# Altium project LINDIY_Proj.PrjPCB
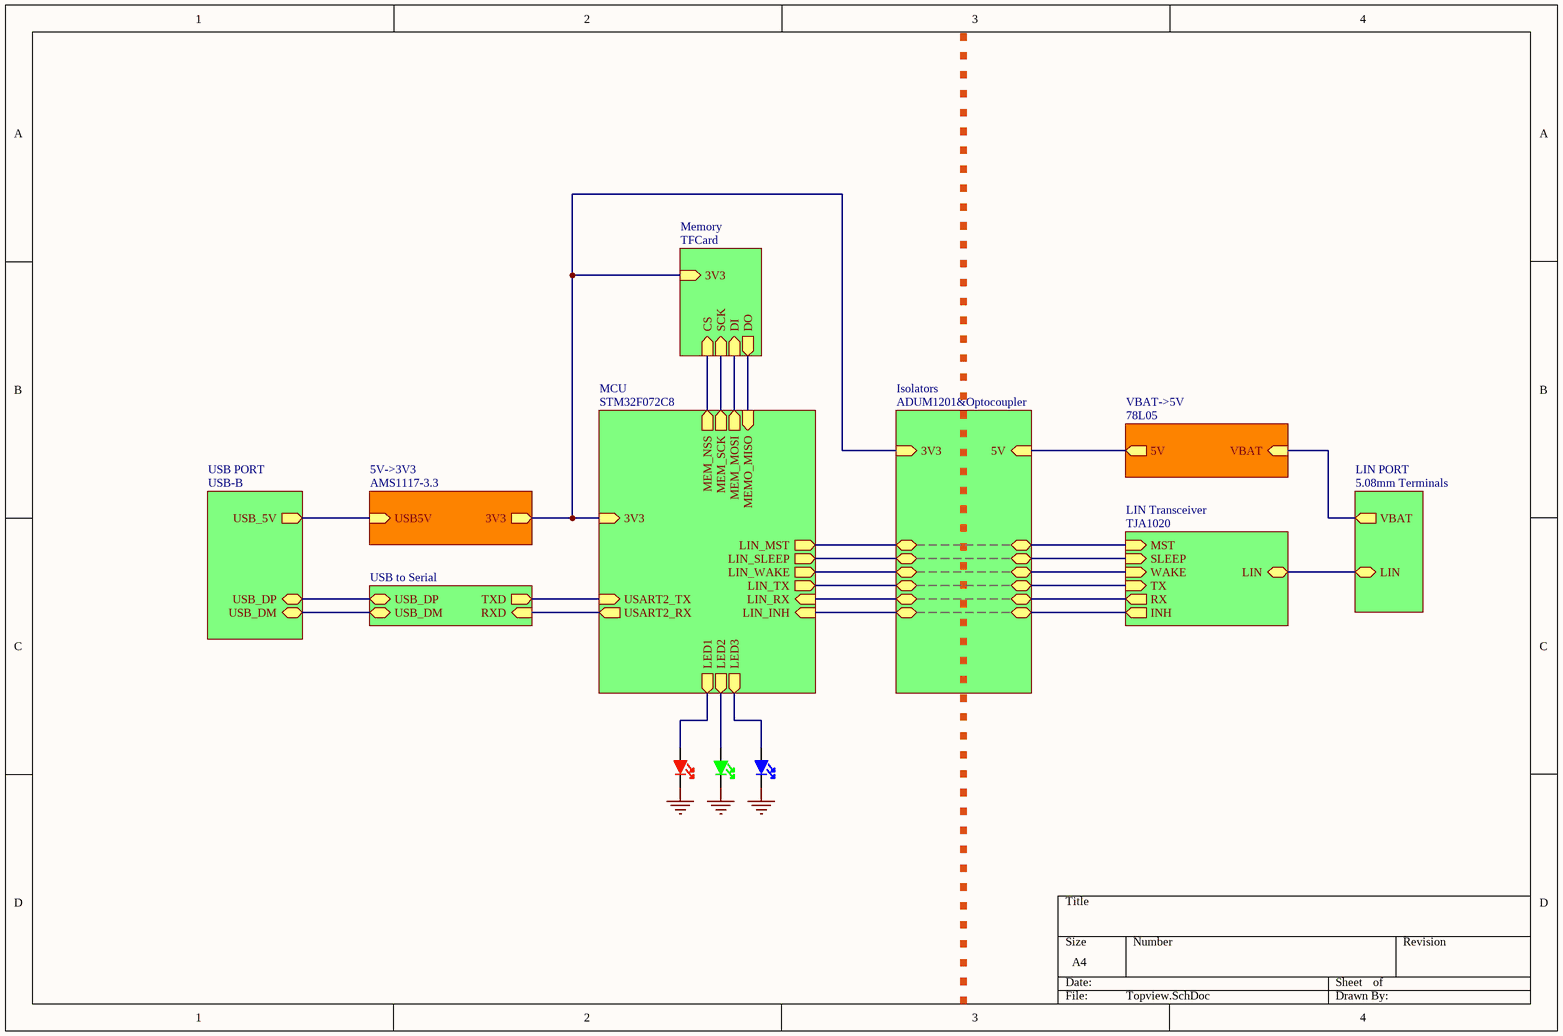
[diagram p0: Topview.SchDoc]
2 sheets, 76 parts. Net scope: hierarchical (ports join the sheet entries above them; power ports are global).
Board files: outline.PcbDoc, LINDIY.PcbDoc
Sheets:
  Topview.SchDoc
  LINDIY.SchDoc

## Sheet Topview.SchDoc
size A4

### Parts
(Parts that share a designator on the sheet are numbered #1, #2 ... from top to bottom, then left to right.)
?#1  LED_RED  [LED3]  (value not drawn)
?#2  LED_GREEG  [LED3]  (value not drawn)
?#3  LED_RED  [LED3]  (value not drawn)

### Sub-sheets
5V->3V3 = AMS1117-3.3 (file not in this document): USB5V (in), 3V3 (out)
Isolators = ADUM1201&Optocoupler (file not in this document): 3V3 (in), 5V (in), , , , , , , , , , , , 
LIN PORT = 5.08mm Terminals (file not in this document): VBAT (out), LIN
LIN Transceiver = TJA1020 (file not in this document): LIN, TX (in), RX (out), SLEEP (in), WAKE (in), INH (out), MST (in)
MCU = STM32F072C8 (file not in this document): USART2_TX, USART2_RX, LIN_TX (out), LIN_RX (in), LIN_SLEEP (out), LIN_WAKE (out), LIN_INH (in), MEM_NSS (out), MEM_SCK (out), MEM_MOSI (out), MEMO_MISO (in), LED1 (out), LED2 (out), LED3 (out), LIN_MST (out), 3V3 (in)
Memory = TFCard (file not in this document): CS (in), DI (in), SCK (in), DO (out), 3V3 (in)
USB PORT = USB-B (file not in this document): USB_DM, USB_DP, USB_5V (out)
USB to Serial = ?: USB_DP, TXD, RXD, USB_DM
VBAT->5V = 78L05 (file not in this document): VBAT (in), 5V (out)

### Nets
Net?#1_K: ?#1.K(k) ?#2.K(k) ?#3.K(k)
Net?#1_A: ?#1.A(a) ; sheet MCU/LED1
Net?#2_A: ?#2.A(a) ; sheet MCU/LED2
Net?#3_A: ?#3.A(a) ; sheet MCU/LED3
(unnamed): sheet USB PORT/USB_DM, sheet USB to Serial/USB_DM
(unnamed): sheet USB PORT/USB_DP, sheet USB to Serial/USB_DP
(unnamed): sheet USB PORT/USB_5V, sheet 5V->3V3/USB5V
(unnamed): sheet 5V->3V3/3V3, sheet MCU/3V3, sheet Memory/3V3, sheet Isolators/3V3
(unnamed): sheet USB to Serial/TXD, sheet MCU/USART2_TX
(unnamed): sheet USB to Serial/RXD, sheet MCU/USART2_RX
(unnamed): sheet LIN Transceiver/LIN, sheet LIN PORT/LIN
(unnamed): sheet LIN Transceiver/TX, sheet Isolators/
(unnamed): sheet LIN Transceiver/RX, sheet Isolators/
(unnamed): sheet LIN Transceiver/SLEEP, sheet Isolators/
(unnamed): sheet LIN Transceiver/WAKE, sheet Isolators/
(unnamed): sheet LIN Transceiver/INH, sheet Isolators/
(unnamed): sheet LIN Transceiver/MST, sheet Isolators/
(unnamed): sheet MCU/LIN_TX, sheet Isolators/
(unnamed): sheet MCU/LIN_RX, sheet Isolators/
(unnamed): sheet MCU/LIN_SLEEP, sheet Isolators/
(unnamed): sheet MCU/LIN_WAKE, sheet Isolators/
(unnamed): sheet MCU/LIN_INH, sheet Isolators/
(unnamed): sheet MCU/MEM_NSS, sheet Memory/CS
(unnamed): sheet MCU/MEM_SCK, sheet Memory/SCK
(unnamed): sheet MCU/MEM_MOSI, sheet Memory/DI
(unnamed): sheet MCU/MEMO_MISO, sheet Memory/DO
(unnamed): sheet MCU/LIN_MST, sheet Isolators/
(unnamed): sheet LIN PORT/VBAT, sheet VBAT->5V/VBAT
(unnamed): sheet VBAT->5V/5V, sheet Isolators/5V

### Library data of the parts
?#1 = LED-R
?#2 = LED-G
?#3 = LED-B

## Sheet LINDIY.SchDoc
size A3
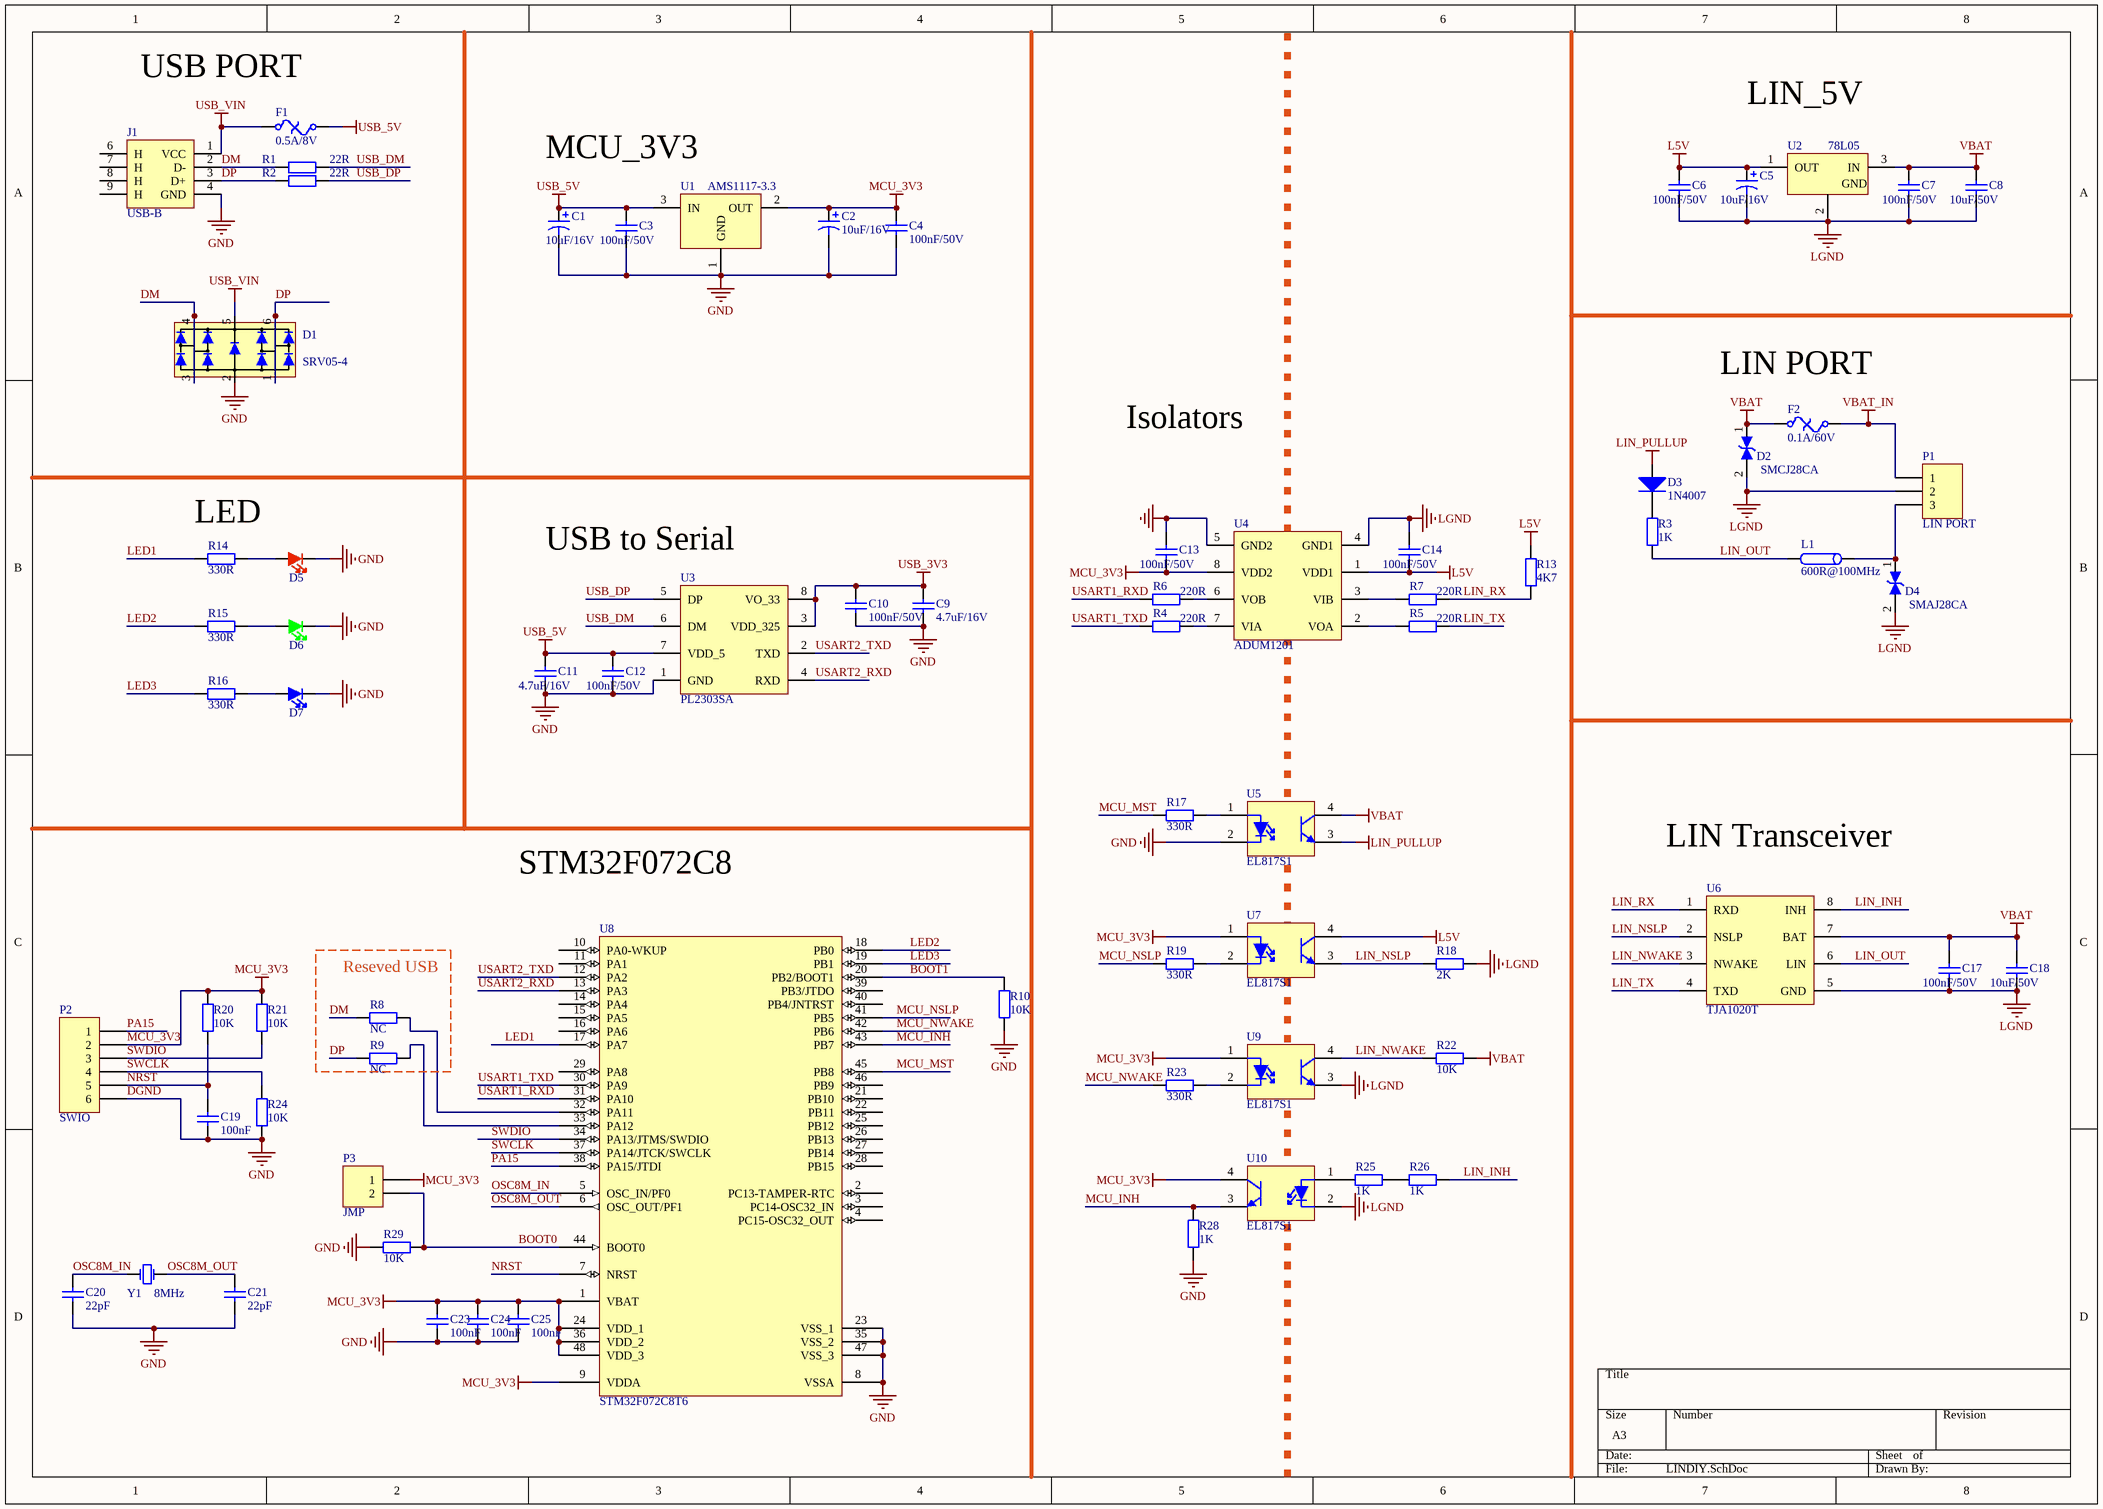
[diagram p1: LINDIY.SchDoc]

### Parts
C1  10uF/16V  [LC-CASE-A_3216]
C2  10uF/16V  [LC-CASE-A_3216]
C3  100nF/50V  [LC-0603_C]
C4  100nF/50V  [LC-0603_C]
C5  10uF/16V  [LC-CASE-A_3216]
C6  100nF/50V  [LC-0603_C]
C7  100nF/50V  [LC-0603_C]
C8  10uF/50V  [LC-1206_C]
C9  4.7uF/16V  [LC-0603_C]
C10  100nF/50V  [LC-0603_C]
C11  4.7uF/16V  [LC-0603_C]
C12  100nF/50V  [LC-0603_C]
C13  100nF/50V  [LC-0603_C]
C14  100nF/50V  [LC-0603_C]
C17  100nF/50V  [LC-0603_C]
C18  10uF/50V  [LC-1206_C]
C19  100nF  [LC-0603_C]
C20  22pF  [LC-0603_C]
C21  22pF  [LC-0603_C]
C23  100nF  [LC-0603_C]
C24  100nF  [LC-0603_C]
C25  100nF  [LC-0603_C]
D1  SRV05-4  [LC-SOT-23-6]
D2  SMCJ28CA  [LC-SMC(DO-214AB)_S1]
D3  1N4007  [LC-SMA(DO-214AC)_S1]
D4  SMAJ28CA  [LC-SMA(DO-214AC)_S1]
D5  LED_RED  [LC-0805_LED_S1]  (value not drawn)
D6  LED_GREEG  [LC-0805_LED_S1]  (value not drawn)
D7  LED_RED  [LC-0805_LED_S1]  (value not drawn)
F1  0.5A/8V  [LC-1206_R]
F2  0.1A/60V  [LC-1206_R]
J1  USB-B  [USB/B]
L1  600R@100MHz  [LC-1206_L]
P1  LIN PORT  [5.08-3]
P2  SWIO  [HDR1X6]
P3  JMP  [HDR1X2]
R1  22R  [LC-0603_R]
R2  22R  [LC-0603_R]
R3  1K  [LC-1206_R]
R4  220R  [LC-0603_R]
R5  220R  [LC-0603_R]
R6  220R  [LC-0603_R]
R7  220R  [LC-0603_R]
R8  NC  [LC-0603_R]
R9  NC  [LC-0603_R]
R10  10K  [LC-0603_R]
R13  4K7  [LC-0603_R]
R14  330R  [LC-0603_R]
R15  330R  [LC-0603_R]
R16  330R  [LC-0603_R]
R17  330R  [LC-0603_R]
R18  2K  [LC-0603_R]
R19  330R  [LC-0603_R]
R20  10K  [LC-0603_R]
R21  10K  [LC-0603_R]
R22  10K  [LC-0603_R]
R23  330R  [LC-0603_R]
R24  10K  [LC-0603_R]
R25  1K  [LC-1206_R]
R26  1K  [LC-1206_R]
R28  1K  [LC-0603_R]
R29  10K  [LC-0603_R]
U1  AMS1117-3.3  [LC-SOT-223]
U2  78L05  [LC-SOT-89(SOT-89-3)]
U3  PL2303SA  [LC-SO-8_3.9mm]
U4  ADUM1201  [LC-SO-8_3.9mm]
U5  EL817S1  [LC-SMD-4]
U6  TJA1020T  [LC-SOIC-8_150mil]
U7  EL817S1  [LC-SMD-4]
U8  STM32F072C8T6  [LC-LQFP-48_7x7x05P]
U9  EL817S1  [LC-SMD-4]
U10  EL817S1  [LC-SMD-4]
Y1  8MHz  [LC-SMD-3225_4P]

### Blocks framed on the sheet
Reseved USB: R8 R9

### Nets
DGND: C1.2 C2.2 C3.2 C4.2 C9.2 C10.2 C11.2 C12.2 C13.1 C19.2 C20.2 C21.2 C23.2 C24.2 C25.2 D1.2 D5.K(k) D6.K(k) D7.K(k) J1.4(GND) P2.6 R10.1 R24.2 R28.1 R29.1 U1.1(GND) U3.1(GND) U4.5(GND2) U5.2 U8.8(VSSA) U8.23(VSS_1) U8.35(VSS_2) U8.47(VSS_3)  [also labelled GND]
L5V: C5.1 C6.1 C14.2 R13.2 U2.1(OUT) U4.1(VDD1) U7.4
LGND: C5.2 C6.2 C7.2 C8.2 C14.1 C17.2 C18.2 D2.2 D4.2 P1.2 R18.1 U2.2(GND) U4.4(GND1) U6.5(GND) U9.3 U10.2
LIN_PULLUP: D3.1(A) U5.3
MCU_3V3: C2.1 C4.1 C13.2 C23.1 C24.1 C25.1 P2.2 P3.1 R20.1 R21.1 U1.2(OUT) U4.8(VDD2) U7.1 U8.1(VBAT) U8.9(VDDA) U8.24(VDD_1) U8.36(VDD_2) U8.48(VDD_3) U9.1 U10.4
USB_3V3: C9.1 C10.1 U3.3(VDD_325) U3.8(VO_33)
USB_5V: C1.1 C3.1 C11.1 C12.1 F1.2 U1.3(IN) U3.7(VDD_5)
USB_VIN: D1.5 F1.1 J1.1(VCC)
VBAT: C7.1 C8.1 C17.1 C18.1 D2.1 F2.1 R22.1 U2.3(IN) U5.4 U6.7(BAT)
VBAT_IN: F2.2 P1.1
BOOT0: P3.2 R29.2 U8.44(BOOT0)
BOOT1: R10.2 U8.20(PB2/BOOT1)
DM: D1.3 D1.4 J1.2(D-) R1.1 R8.1
DP: D1.1 D1.6 J1.3(D+) R2.1 R9.1
LED1: R14.1 U8.17(PA7)
LED2: R15.1 U8.18(PB0)
LED3: R16.1 U8.19(PB1)
LIN_INH: R26.1 U6.8(INH)
LIN_NSLP: R18.2 U6.2(NSLP) U7.3
LIN_NWAKE: R22.2 U6.3(NWAKE) U9.4
LIN_OUT: L1.2 R3.1 U6.6(LIN)
LIN_RX: R7.2 R13.1 U6.1(RXD)
LIN_TX: R5.2 U6.4(TXD)
MCU_INH: R28.2 U8.43(PB7) U10.3
MCU_MST: R17.1 U8.45(PB8)
MCU_NSLP: R19.1 U8.41(PB5)
MCU_NWAKE: R23.1 U8.42(PB6)
NRST: C19.1 P2.5 R20.2 U8.7(NRST)
OSC8M_IN: C20.1 U8.5(OSC_IN/PF0) Y1.3(OSC2)
OSC8M_OUT: C21.1 U8.6(OSC_OUT/PF1) Y1.1(OSC1)
PA15: P2.1 U8.38(PA15/JTDI)
SWCLK: P2.4 R24.1 U8.37(PA14/JTCK/SWCLK)
SWDIO: P2.3 R21.2 U8.34(PA13/JTMS/SWDIO)
USART1_RXD: R6.1 U8.31(PA10)
USART1_TXD: R4.1 U8.30(PA9)
USART2_RXD: U3.4(RXD) U8.13(PA3)
USART2_TXD: U3.2(TXD) U8.12(PA2)
USB_DM: R1.2 U3.6(DM)
USB_DP: R2.2 U3.5(DP)
NetD3_2: D3.2(K) R3.2
NetD4_1: D4.1 L1.1 P1.3
NetD5_A: D5.A(a) R14.2
NetD6_A: D6.A(a) R15.2
NetD7_A: D7.A(a) R16.2
NetR4_2: R4.2 U4.7(VIA)
NetR5_1: R5.1 U4.2(VOA)
NetR6_2: R6.2 U4.6(VOB)
NetR7_1: R7.1 U4.3(VIB)
NetR8_2: R8.2 U8.32(PA11)
NetR9_2: R9.2 U8.33(PA12)
NetR17_2: R17.2 U5.1
NetR19_2: R19.2 U7.2
NetR23_2: R23.2 U9.2
NetR25_1: R25.1 R26.2
NetR25_2: R25.2 U10.1

Not connected (* = marked no-connect by the designer): J1 6(H) 7(H) 8(H) 9(H); U8 2(PC13-TAMPER-RTC) 3(PC14-OSC32_IN) 4(PC15-OSC32_OUT) 10(PA0-WKUP) 11(PA1) 14(PA4) 15(PA5) 16(PA6) 21(PB10) 22(PB11) 25(PB12) 26(PB13) 27(PB14) 28(PB15) 29(PA8) 39(PB3/JTDO) 40(PB4/JNTRST) 46(PB9)

### Notes on the sheet
- (near F1) USB PORT
- LIN_5V
- MCU_3V3
- LIN PORT
- Isolators
- (near R14) LED
- (near U3) USB to Serial
- LIN Transceiver
- STM32F072C8

### Library data of the parts
C1 C2 C5 = Cap Pol2: Polarized Capacitor (Axial); Published: 8-Jun-2000; LatestRevisionDate: 17-Jul-2002; LatestRevisionNote: Re-released for DXP Platform.; PackageReference: POLAR0.8; Publisher: Altium Limited; Value: 10uF/16V
C3 C4 C6-C14 C17-C21 C23-C25 = Cap: Capacitor; Published: 8-Jun-2000; LatestRevisionDate: 17-Jul-2002; LatestRevisionNote: Re-released for DXP Platform.; PackageReference: RAD-0.3; Publisher: Altium Limited
  C3 C4 C6 C7 C10 C12-C14 C17: Value: 100nF/50V
  C8 C18: Value: 10uF/50V
  C9 C11: Value: 4.7uF/16V
  C19 C23-C25: Value: 100nF
  C20 C21: Value: 22pF
D1 = SRV05-4: Low Capacitance TVS Diode Array
D2 D4 = P6KE6.8CA: Zener Diode
D3 = Diode BAS116: Silicon Low Leakage Diode; Note: Pin 2 is not connected and not drawn.; Published: 21-Mar-2003; DatasheetDocument: Oct-1999; PackageDocument: Sep-2001; PackageReference: SOT-23; Publisher: Altium Limited; ComponentLink1Description: Manufacturer Link; ComponentLink1URL: http://www.infineon.com/; ComponentLink2Description: Datasheet; ComponentLink2URL: http://www.infineon.com/upload/Document/cmc_upload/documents/080/656/bas116series.pdf
D5 = LED-R
D6 = LED-G
D7 = LED-B
F1 F2 = Fuse Thermal: Thermal Fuse; Published: 24-Mar-1999; LatestRevisionDate: 17-Jul-2002; LatestRevisionNote: Re-released for DXP Platform.; PackageReference: PIN-W2/E2.8; Publisher: Altium Limited
J1 = MINI-USB
L1 = FerriteBeads
P1 = Header 3: Header, 3-Pin; LatestRevisionDate: 17-Jul-2002; LatestRevisionNote: Re-released for DXP Platform.; Publisher: Altium Limited
P2 = Header 6: Header, 6-Pin; LatestRevisionDate: 17-Jul-2002; LatestRevisionNote: Re-released for DXP Platform.; Publisher: Altium Limited
P3 = Header 2: Header, 2-Pin; LatestRevisionDate: 17-Jul-2002; LatestRevisionNote: Re-released for DXP Platform.; Publisher: Altium Limited
R1-R7 R10 R13-R17 R19-R26 R28 R29 = Res2: Resistor; Published: 8-Jun-2000; LatestRevisionDate: 17-Jul-2002; LatestRevisionNote: Re-released for DXP Platform.; PackageReference: AXIAL-0.4; Publisher: Altium Limited
  R1 R2: Value: 22R
  R3 R25 R26 R28: Value: 1K
  R4-R7: Value: 220R
  R10 R20-R22 R24 R29: Value: 10K
  R13: Value: 4K7
  R14-R17 R19 R23: Value: 330R
R8 R9 = Res2: Resistor; Value: 22R; Published: 8-Jun-2000; LatestRevisionDate: 17-Jul-2002; LatestRevisionNote: Re-released for DXP Platform.; PackageReference: AXIAL-0.4; Publisher: Altium Limited
R18 = Res2: Resistor; Value: 4K7; Published: 8-Jun-2000; LatestRevisionDate: 17-Jul-2002; LatestRevisionNote: Re-released for DXP Platform.; PackageReference: AXIAL-0.4; Publisher: Altium Limited
U1 = AMS1117
U2 = MC7805ACT: Three-Terminal Positive Voltage Regulator; Note: Heatsink surface is connected to Pin 2; Published: 15-Apr-2002; DatasheetVersion: 1997; PackageVersion: 1997; PackageReference: 221A-06; Publisher: Altium Limited; PackageDescription: TO, Thru-Hole, Vertical, Heatsink Mounted; 3 In-Line Leads; Pitch 2.54 mm; Code_JEDEC: TO-262-AA; ComponentLink1Description: Manufacturer Link; ComponentLink1URL: http://www.onsemi.com/site/products/taxonomy/0,4438,503,00.html; ComponentLink2Description: Datasheet; ComponentLink2URL: http://www.onsemi.com/pub/Collateral/MC7800-D.PDF
U3 = PL2303SA: USB to Serial Bridge Controller (SOP8 Package)
U4 = ADUM1201: Dual-Channel Digital Isolators
U5 U7 U9 U10 = TLP521-1
U6 = TJA1020: LIN transceiver
U8 = STM32F103C8T6: STM32 ARM-based 32-bit MCU with 64 Kbytes Flash, 48-pin LQFP, Industrial Temperature; Published: 30-May-2008; DatasheetVersion: rev6, Mar-2008; PackageVersion: Mar-2008; PackageReference: LQFP48; Publisher: Altium Limited; PackageDescription: 48-Pin Low-Profile Quad Flat Pack, 7 x 7 mm Body, 0.5 mm Pitch (LQFP48); ComponentLink1Description: Manufacturer Link; ComponentLink1URL: www.st.com/stm32; ComponentLink2Description: Datasheet; ComponentLink2URL: http://www.st.com/stonline/products/literature/ds/13587.pdf
Y1 = XTAL: Crystal Oscillator; Published: 8-Jun-2000; LatestRevisionDate: 17-Jul-2002; LatestRevisionNote: Re-released for DXP Platform.; PackageReference: R38; Publisher: Altium Limited